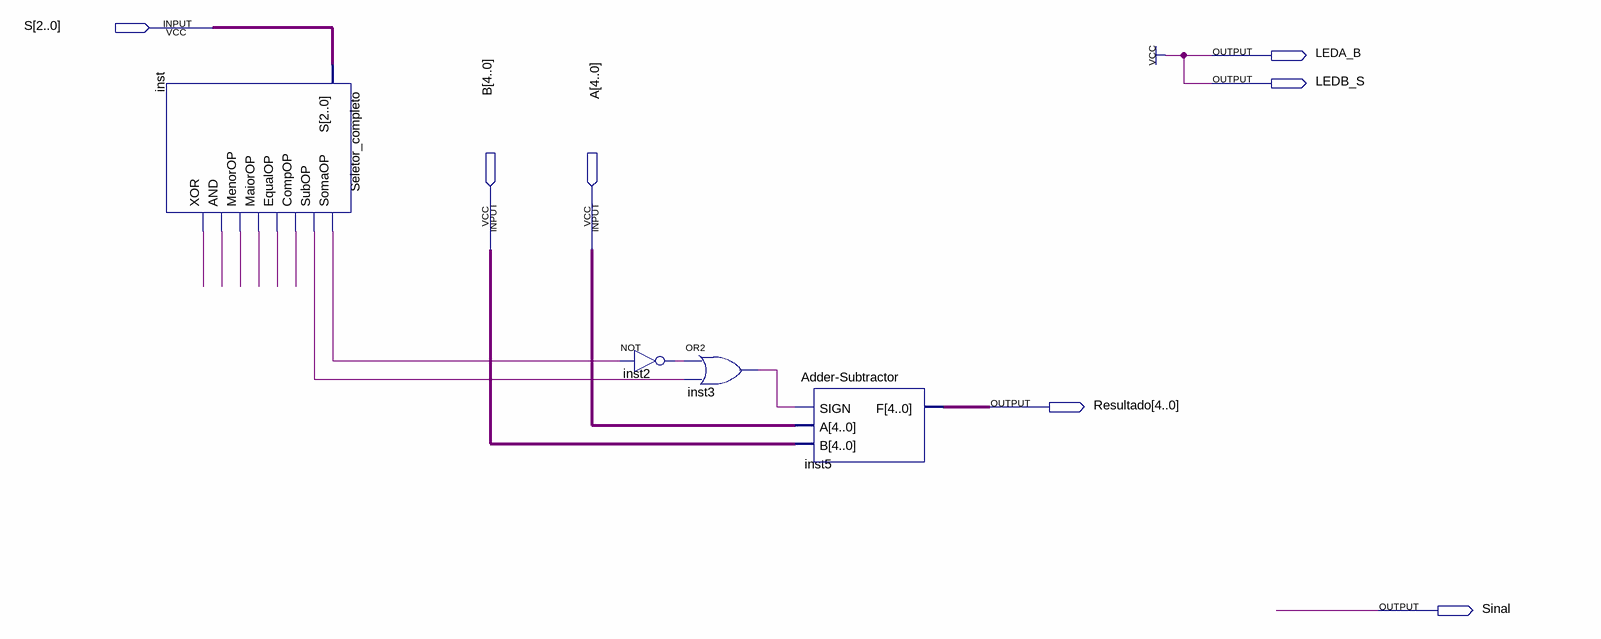
[diagram p0: schematic sheet]
// Quartus schematic Projetao.bdf as structural Verilog: 4 symbols, 7 pins
module Projetao (
  input  [2:0] S,
  input  [4:0] B,
  input  [4:0] A,
  output LEDA_B,
  output LEDB_S,
  output [4:0] Resultado,
  output Sinal
);

  wire inst2_out, inst3_out, inst_and, inst_compop, inst_equalop, inst_maiorop, inst_menorop, inst_somaop,
       inst_subop, inst_xor;

  Seletor_completo inst (
    .S(S), .SomaOP(inst_somaop), .SubOP(inst_subop), .CompOP(inst_compop), .EqualOP(inst_equalop),
    .MaiorOP(inst_maiorop), .MenorOP(inst_menorop), .AND(inst_and), .XOR(inst_xor));
  not inst2 (inst2_out, inst_somaop);
  or inst3 (inst3_out, inst2_out, inst_subop);
  \Adder-Subtractor  inst5 (.SIGN(inst3_out), .A(A), .B(B), .F(Resultado));

  assign LEDA_B = 1'b1;
  assign LEDB_S = 1'b1;
endmodule
